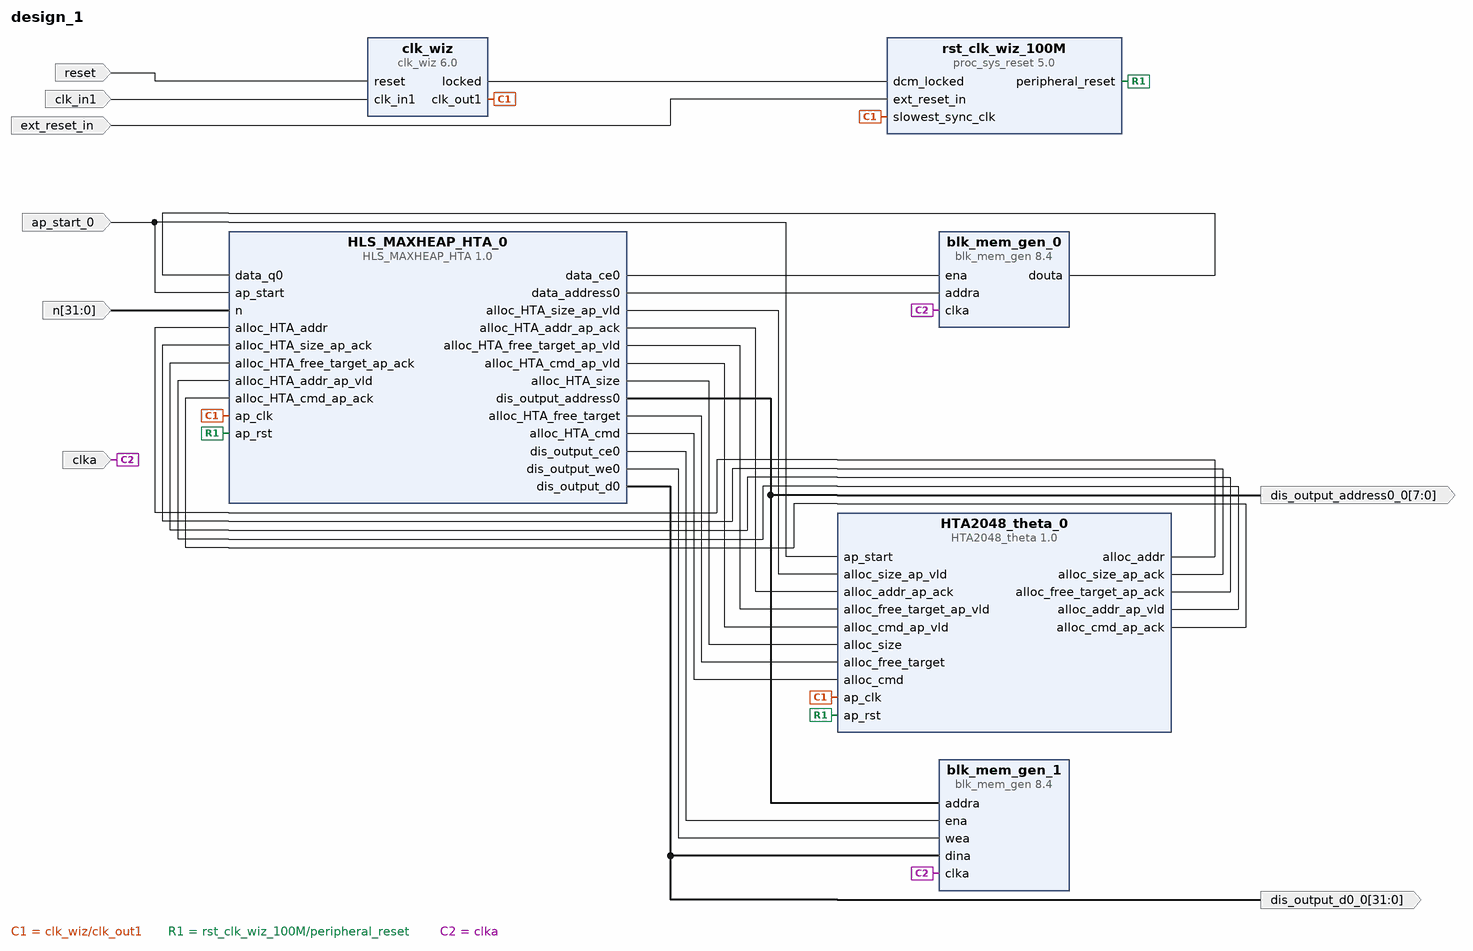
[diagram p0: block diagram of the top level]
# Vivado block design design_1, xc7z020clg484-1, Vivado 2018.2
create_bd_design design_1

create_bd_port -dir I -from 31 -to 0 -type data n
set_property -dict [list \
  CONFIG.LAYERED_METADATA {xilinx.com:interface:datatypes:1.0 {DATA {datatype {name {attribs {resolve_type immediate dependency {} format string minimum {} maximum {}} value {}} bitwidth {attribs {resolve_type immediate dependency {} format long minimum {} maximum {}} value 32} bitoffset {attribs {resolve_type immediate dependency {} format long minimum {} maximum {}} value 0} integer {signed {attribs {resolve_type immediate dependency {} format bool minimum {} maximum {}} value true}}}}}} \
] [get_bd_ports n]
create_bd_port -dir I -type rst reset
set_property -dict {CONFIG.POLARITY ACTIVE_HIGH} [get_bd_ports reset]
create_bd_port -dir I -type clk clk_in1
create_bd_port -dir I -type rst ext_reset_in
create_bd_port -dir I -type clk clka
create_bd_port -dir I ap_start_0
create_bd_port -dir O -from 7 -to 0 -type data dis_output_address0_0
create_bd_port -dir O -from 31 -to 0 -type data dis_output_d0_0

create_bd_cell -type ip -vlnv xilinx.com:ip:blk_mem_gen:8.4 blk_mem_gen_0
set_property -dict [list \
  CONFIG.Memory_Type True_Dual_Port_RAM \
  CONFIG.Enable_32bit_Address false \
  CONFIG.Use_Byte_Write_Enable false \
  CONFIG.Write_Depth_A 20000 \
  CONFIG.Operating_Mode_A NO_CHANGE \
  CONFIG.Enable_B Use_ENB_Pin \
  CONFIG.Register_PortA_Output_of_Memory_Primitives true \
  CONFIG.Register_PortB_Output_of_Memory_Primitives true \
  CONFIG.Load_Init_File true \
  CONFIG.Coe_File ../../../../../../../design_1_blk_mem_gen_0_0.coe \
  CONFIG.Use_RSTA_Pin false \
  CONFIG.Port_B_Clock 100 \
  CONFIG.Port_B_Write_Rate 50 \
  CONFIG.Port_B_Enable_Rate 100 \
  CONFIG.use_bram_block Stand_Alone \
] [get_bd_cells blk_mem_gen_0]
create_bd_cell -type ip -vlnv xilinx.com:ip:blk_mem_gen:8.4 blk_mem_gen_1
set_property -dict [list \
  CONFIG.Enable_32bit_Address false \
  CONFIG.Use_Byte_Write_Enable false \
  CONFIG.Write_Depth_A 200 \
  CONFIG.Register_PortA_Output_of_Memory_Primitives true \
  CONFIG.Use_RSTA_Pin false \
  CONFIG.use_bram_block Stand_Alone \
] [get_bd_cells blk_mem_gen_1]
create_bd_cell -type ip -vlnv xilinx.com:ip:clk_wiz:6.0 clk_wiz
create_bd_cell -type ip -vlnv xilinx.com:ip:proc_sys_reset:5.0 rst_clk_wiz_100M
create_bd_cell -type ip -vlnv xilinx.com:hls:HLS_MAXHEAP_HTA:1.0 HLS_MAXHEAP_HTA_0
create_bd_cell -type ip -vlnv xilinx.com:hls:HTA2048_theta:1.0 HTA2048_theta_0

# ---- connections ----

connect_bd_net [get_bd_ports n] [get_bd_pins HLS_MAXHEAP_HTA_0/n]
connect_bd_net [get_bd_pins blk_mem_gen_0/douta] [get_bd_pins HLS_MAXHEAP_HTA_0/data_q0]
connect_bd_net [get_bd_pins HLS_MAXHEAP_HTA_0/data_ce0] [get_bd_pins blk_mem_gen_0/ena]
connect_bd_net [get_bd_pins HLS_MAXHEAP_HTA_0/data_address0] [get_bd_pins blk_mem_gen_0/addra]
connect_bd_net [get_bd_pins HLS_MAXHEAP_HTA_0/dis_output_ce0] [get_bd_pins blk_mem_gen_1/ena]
connect_bd_net [get_bd_pins HLS_MAXHEAP_HTA_0/dis_output_we0] [get_bd_pins blk_mem_gen_1/wea]
connect_bd_net [get_bd_pins clk_wiz/clk_out1] \
  [get_bd_pins rst_clk_wiz_100M/slowest_sync_clk] [get_bd_pins HLS_MAXHEAP_HTA_0/ap_clk] [get_bd_pins HTA2048_theta_0/ap_clk]
connect_bd_net [get_bd_pins clk_wiz/locked] [get_bd_pins rst_clk_wiz_100M/dcm_locked]
connect_bd_net [get_bd_pins rst_clk_wiz_100M/peripheral_reset] [get_bd_pins HLS_MAXHEAP_HTA_0/ap_rst] [get_bd_pins HTA2048_theta_0/ap_rst]
connect_bd_net [get_bd_ports reset] [get_bd_pins clk_wiz/reset]
connect_bd_net -net clk_in1_1 [get_bd_ports clk_in1] [get_bd_pins clk_wiz/clk_in1]
connect_bd_net [get_bd_ports ext_reset_in] [get_bd_pins rst_clk_wiz_100M/ext_reset_in]
connect_bd_net [get_bd_ports clka] [get_bd_pins blk_mem_gen_0/clka] [get_bd_pins blk_mem_gen_1/clka]
connect_bd_net -net ap_start_0_1 [get_bd_ports ap_start_0] [get_bd_pins HLS_MAXHEAP_HTA_0/ap_start] [get_bd_pins HTA2048_theta_0/ap_start]
connect_bd_net [get_bd_pins HLS_MAXHEAP_HTA_0/dis_output_address0] [get_bd_ports dis_output_address0_0] [get_bd_pins blk_mem_gen_1/addra]
connect_bd_net [get_bd_pins HLS_MAXHEAP_HTA_0/dis_output_d0] [get_bd_ports dis_output_d0_0] [get_bd_pins blk_mem_gen_1/dina]
connect_bd_net [get_bd_pins HLS_MAXHEAP_HTA_0/alloc_HTA_size_ap_vld] [get_bd_pins HTA2048_theta_0/alloc_size_ap_vld]
connect_bd_net [get_bd_pins HLS_MAXHEAP_HTA_0/alloc_HTA_addr_ap_ack] [get_bd_pins HTA2048_theta_0/alloc_addr_ap_ack]
connect_bd_net [get_bd_pins HLS_MAXHEAP_HTA_0/alloc_HTA_free_target_ap_vld] [get_bd_pins HTA2048_theta_0/alloc_free_target_ap_vld]
connect_bd_net [get_bd_pins HLS_MAXHEAP_HTA_0/alloc_HTA_cmd_ap_vld] [get_bd_pins HTA2048_theta_0/alloc_cmd_ap_vld]
connect_bd_net [get_bd_pins HLS_MAXHEAP_HTA_0/alloc_HTA_size] [get_bd_pins HTA2048_theta_0/alloc_size]
connect_bd_net [get_bd_pins HLS_MAXHEAP_HTA_0/alloc_HTA_free_target] [get_bd_pins HTA2048_theta_0/alloc_free_target]
connect_bd_net [get_bd_pins HLS_MAXHEAP_HTA_0/alloc_HTA_cmd] [get_bd_pins HTA2048_theta_0/alloc_cmd]
connect_bd_net [get_bd_pins HTA2048_theta_0/alloc_addr] [get_bd_pins HLS_MAXHEAP_HTA_0/alloc_HTA_addr]
connect_bd_net [get_bd_pins HTA2048_theta_0/alloc_size_ap_ack] [get_bd_pins HLS_MAXHEAP_HTA_0/alloc_HTA_size_ap_ack]
connect_bd_net [get_bd_pins HTA2048_theta_0/alloc_free_target_ap_ack] [get_bd_pins HLS_MAXHEAP_HTA_0/alloc_HTA_free_target_ap_ack]
connect_bd_net [get_bd_pins HTA2048_theta_0/alloc_addr_ap_vld] [get_bd_pins HLS_MAXHEAP_HTA_0/alloc_HTA_addr_ap_vld]
connect_bd_net [get_bd_pins HTA2048_theta_0/alloc_cmd_ap_ack] [get_bd_pins HLS_MAXHEAP_HTA_0/alloc_HTA_cmd_ap_ack]

validate_bd_design
save_bd_design
